# Altium schematic sheet Operations_Microcontroller.SchDoc
size Letter; SheetNumber: 10; SheetTotal: 13
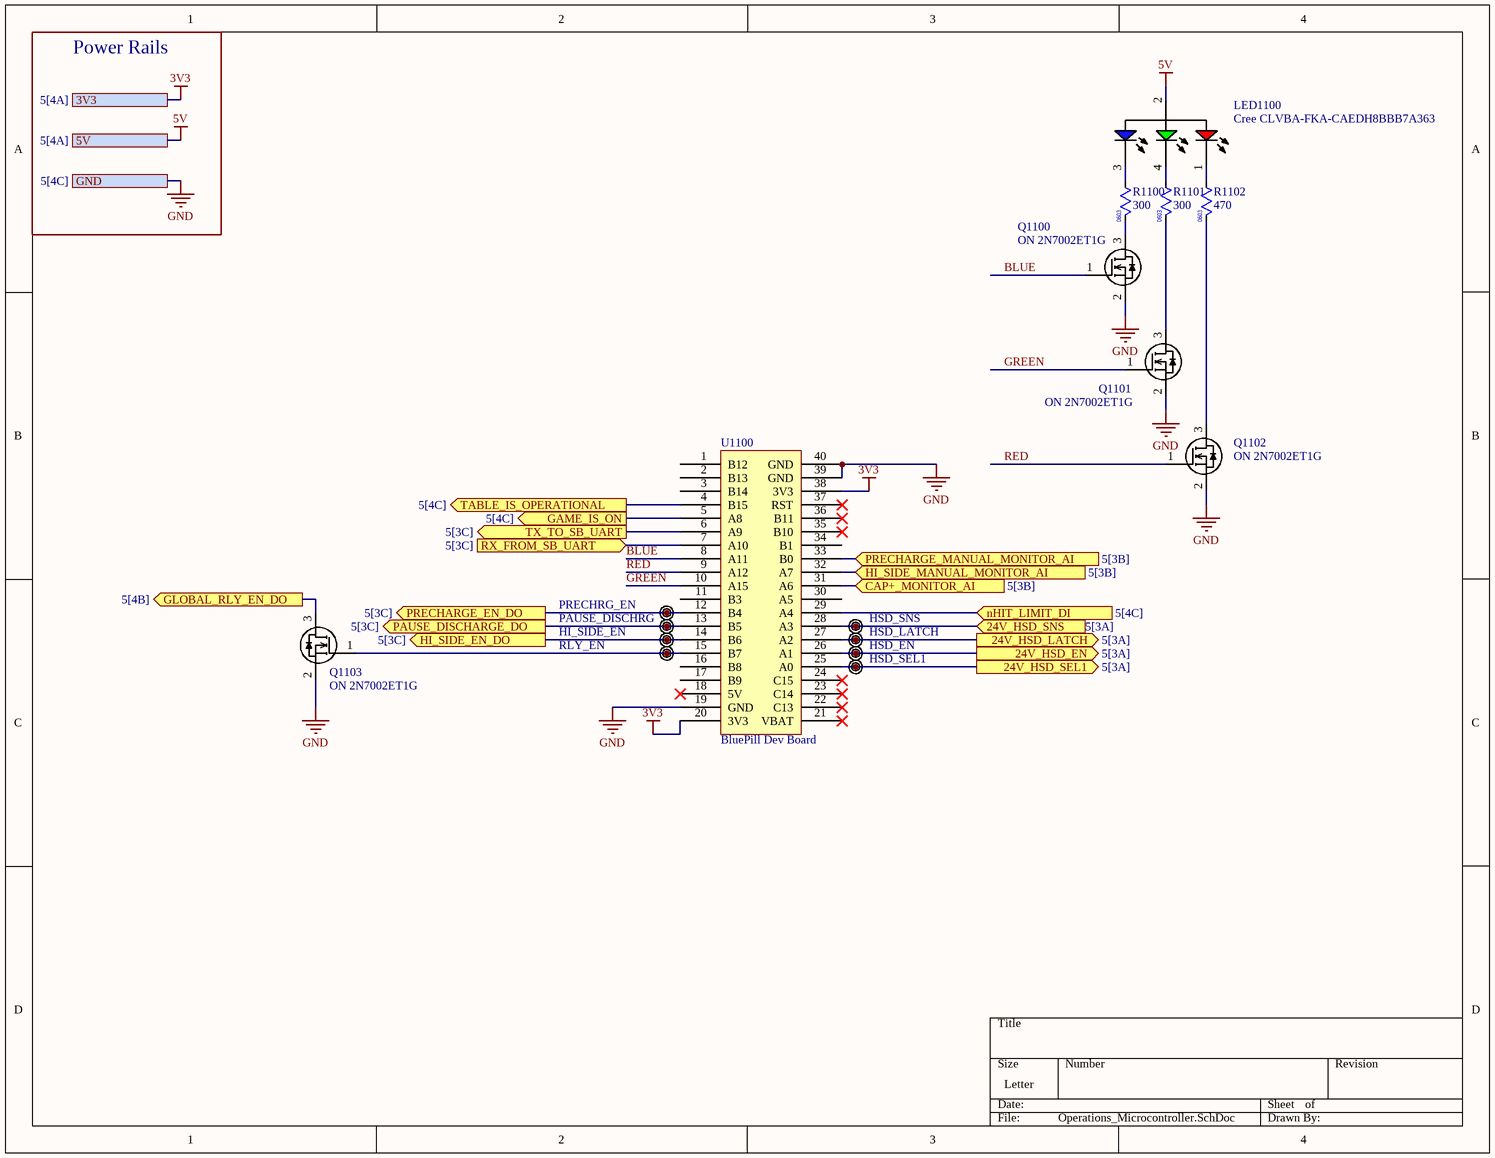
[diagram p0: Operations_Microcontroller.SchDoc]

## Parts
LED1100  Cree CLVBA-FKA-CAEDH8BBB7A363  [Cree CLVBA-FKA-Series (4-SOJ)]
Q1100  ON 2N7002ET1G  [ON SEMI 2N7002ET1G (SOT-23)]
Q1101  ON 2N7002ET1G  [ON SEMI 2N7002ET1G (SOT-23)]
Q1102  ON 2N7002ET1G  [ON SEMI 2N7002ET1G (SOT-23)]
Q1103  ON 2N7002ET1G  [ON SEMI 2N7002ET1G (SOT-23)]
R1100  value 300  [0603 Resistor Footprint]  (hidden comment: 0603 300 1% 0.33W)
R1101  value 300  [0603 Resistor Footprint]  (hidden comment: 0603 300 1% 0.33W)
R1102  value 470  [0603 Resistor Footprint]  (hidden comment: 0603 470R 5% 0.25W)
TP1100  PRECHRG_EN  [TESTPOINT]  (no BOM)
TP1101  PAUSE_DISCHRG  [TESTPOINT]  (no BOM)
TP1102  HSD_SNS  [TESTPOINT]  (no BOM)
TP1103  HI_SIDE_EN  [TESTPOINT]  (no BOM)
TP1104  HSD_LATCH  [TESTPOINT]  (no BOM)
TP1105  RLY_EN  [TESTPOINT]  (no BOM)
TP1106  HSD_EN  [TESTPOINT]  (no BOM)
TP1107  HSD_SEL1  [TESTPOINT]  (no BOM)
U1100  BluePill Dev Board  [Blue Pill]

## Ports
3V3 (see 5[4A]), 5V (see 5[4A]), 24V_HSD_EN (out, see 5[3A]), 24V_HSD_LATCH (out, see 5[3A]), 24V_HSD_SEL1 (out, see 5[3A]), 24V_HSD_SNS (in, see 5[3A]), CAP+_MONITOR_AI (in, see 5[3B]), GAME_IS_ON (out, see 5[4C]), GLOBAL_RLY_EN_DO (out, see 5[4B]), GND (see 5[4C]), HI_SIDE_EN_DO (out, see 5[3C]), HI_SIDE_MANUAL_MONITOR_AI (in, see 5[3B]), nHIT_LIMIT_DI (in, see 5[4C]), PAUSE_DISCHARGE_DO (out, see 5[3C]), PRECHARGE_EN_DO (out, see 5[3C]), PRECHARGE_MANUAL_MONITOR_AI (in, see 5[3B]), RX_FROM_SB_UART (in, see 5[3C]), TABLE_IS_OPERATIONAL (out, see 5[4C]), TX_TO_SB_UART (out, see 5[3C])

## Nets
3V3: U1100.20(3V3) U1100.38(3V3) ; port 3V3
5V: LED1100.2(COMMON_ANODE) ; port 5V
GND: Q1100.2(SOURCE) Q1101.2(SOURCE) Q1102.2(SOURCE) Q1103.2(SOURCE) U1100.19(GND) U1100.39(GND) U1100.40(GND) ; port GND
24V_HSD_EN: TP1106.1(TP) U1100.26(A1) ; port 24V_HSD_EN
24V_HSD_LATCH: TP1104.1(TP) U1100.27(A2) ; port 24V_HSD_LATCH
24V_HSD_SEL1: TP1107.1(TP) U1100.25(A0) ; port 24V_HSD_SEL1
24V_HSD_SNS: TP1102.1(TP) U1100.28(A3) ; port 24V_HSD_SNS
BLUE: Q1100.1(GATE) U1100.8(A11)
CAP+_MONITOR_AI: U1100.31(A6) ; port CAP+_MONITOR_AI
GAME_IS_ON: U1100.5(A8) ; port GAME_IS_ON
GLOBAL_RLY_EN_DO: Q1103.3(DRAIN) ; port GLOBAL_RLY_EN_DO
GREEN: Q1101.1(GATE) U1100.10(A15)
HI_SIDE_EN_DO: TP1103.1(TP) U1100.14(B6) ; port HI_SIDE_EN_DO
HI_SIDE_MANUAL_MONITOR_AI: U1100.32(A7) ; port HI_SIDE_MANUAL_MONITOR_AI
nHIT_LIMIT_DI: U1100.29(A4) ; port nHIT_LIMIT_DI
PAUSE_DISCHARGE_DO: TP1101.1(TP) U1100.13(B5) ; port PAUSE_DISCHARGE_DO
PRECHARGE_EN_DO: TP1100.1(TP) U1100.12(B4) ; port PRECHARGE_EN_DO
PRECHARGE_MANUAL_MONITOR_AI: U1100.33(B0) ; port PRECHARGE_MANUAL_MONITOR_AI
RED: Q1102.1(GATE) U1100.9(A12)
RX_FROM_SB_UART: U1100.7(A10) ; port RX_FROM_SB_UART
TABLE_IS_OPERATIONAL: U1100.4(B15) ; port TABLE_IS_OPERATIONAL
TX_TO_SB_UART: U1100.6(A9) ; port TX_TO_SB_UART
NetLED1100_1: LED1100.1(RED) R1102.1
NetLED1100_3: LED1100.3(BLUE) R1100.1
NetLED1100_4: LED1100.4(GREEN) R1101.1
NetQ1100_3: Q1100.3(DRAIN) R1100.2
NetQ1101_3: Q1101.3(DRAIN) R1101.2
NetQ1102_3: Q1102.3(DRAIN) R1102.2
NetQ1103_1: Q1103.1(GATE) TP1105.1(TP) U1100.15(B7)

Not connected (* = marked no-connect by the designer): U1100 1(B12) 2(B13) 3(B14) 11(B3) 16(B8) 17(B9) 18(5V)* 21(VBAT)* 22(C13)* 23(C14)* 24(C15)* 30(A5) 34(B1) 35(B10)* 36(B11)* 37(RST)*

## Notes on the sheet
- Power Rails

## Library data of the parts
LED1100 = CMP-026-000010-1: LED RGB DIFFUSED 4PLCC SMD; Supplier 1: Digi-Key; Design Item ID: Cree CLVBA-FKA-CAEDH8BBB7A363; Source: UBC Formula Electric.SchLib; Supplier Part Number 1: CLVBA-FKA-CAEDH8BBB7A363CT-ND
Q1100-Q1103 = CMP-016-000005-1: MOSFET N-CH 60V 260MA SOT23-3; Design Item ID: ON 2N7002ET1G; Source: UBC Formula Electric.SchLib; Supplier 1: Digi-Key; Supplier Part Number 1: 2N7002ET1GOSCT-ND
R1100 R1101 = CMP-009-00191-7: RES SMD 300 OHM 1% 1/3W 0603; Manufacturer Part Number: CRCW0603300RFKEAHP; Power: 250mW; Pins: 2; Digikey Part Number: 541-CRCW0603300RFKEAHPCT-ND; Max Operating Temperature: 155°C; Min Operating Temperature: -55°C; Case/Package: 0603; RoHS Compliant: Yes; Mounting Technology: Surface Mount; Tolerance: 1%
R1102 = CMP-009-00193-4: Res Thick Film 0603 470 Ohm 5% 0.25W(1/4W) ±200ppm/C Pad SMD Automotive T/R; Manufacturer Part Number: ERJ-PA3J471V; Power: 250mW; Tolerance: 5%; Max Operating Temperature: 155°C; Digikey Part Number: P470BZCT-ND; Case/Package: 0603; Mounting Technology: Surface Mount; Pins: 2; RoHS Compliant: Yes; Min Operating Temperature: -55°C
TP1100-TP1107 = CMP-020-0000-4: Source: UBC Formula Electric.SchLib; Design Item ID: Thru-Hole Test Point